# Altium schematic sheet sparkfun_nrf52.SchDoc
size A4
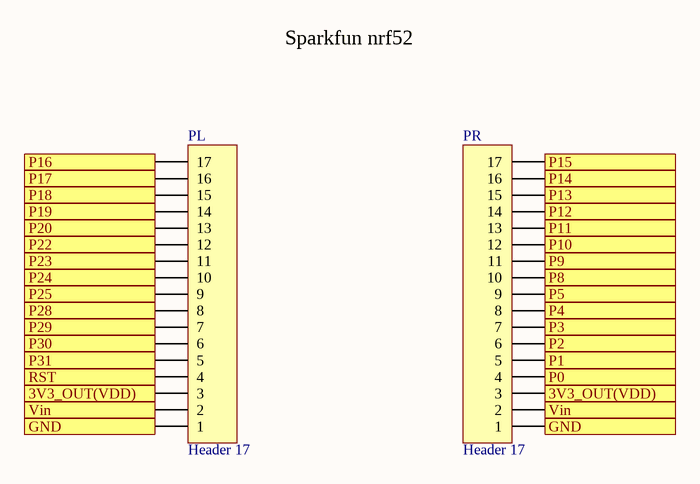
[diagram p0: sparkfun_nrf52.SchDoc]

## Parts
PL  Header 17  [HDR1X17]
PR  Header 17  [HDR1X17]

## Ports
3V3_OUT(VDD), GND, P0, P1, P2, P3, P4, P5, P8, P9, P10, P11, P12, P13, P14, P15, P16, P17, P18, P19, P20, P22, P23, P24, P25, P28, P29, P30, P31, RST, Vin

## Nets
3V3_OUT(VDD): PL.3 PR.3 ; port 3V3_OUT(VDD)
GND: PL.1 PR.1 ; port GND
P0: PR.4 ; port P0
P1: PR.5 ; port P1
P2: PR.6 ; port P2
P3: PR.7 ; port P3
P4: PR.8 ; port P4
P5: PR.9 ; port P5
P8: PR.10 ; port P8
P9: PR.11 ; port P9
P10: PR.12 ; port P10
P11: PR.13 ; port P11
P12: PR.14 ; port P12
P13: PR.15 ; port P13
P14: PR.16 ; port P14
P15: PR.17 ; port P15
P16: PL.17 ; port P16
P17: PL.16 ; port P17
P18: PL.15 ; port P18
P19: PL.14 ; port P19
P20: PL.13 ; port P20
P22: PL.12 ; port P22
P23: PL.11 ; port P23
P24: PL.10 ; port P24
P25: PL.9 ; port P25
P28: PL.8 ; port P28
P29: PL.7 ; port P29
P30: PL.6 ; port P30
P31: PL.5 ; port P31
RST: PL.4 ; port RST
Vin: PL.2 PR.2 ; port Vin

## Notes on the sheet
- Sparkfun nrf52

## Library data of the parts
PL PR = Header 17: Header, 17-Pin; LatestRevisionDate: 17-Jul-2002; LatestRevisionNote: Re-released for DXP Platform.; Publisher: Altium Limited